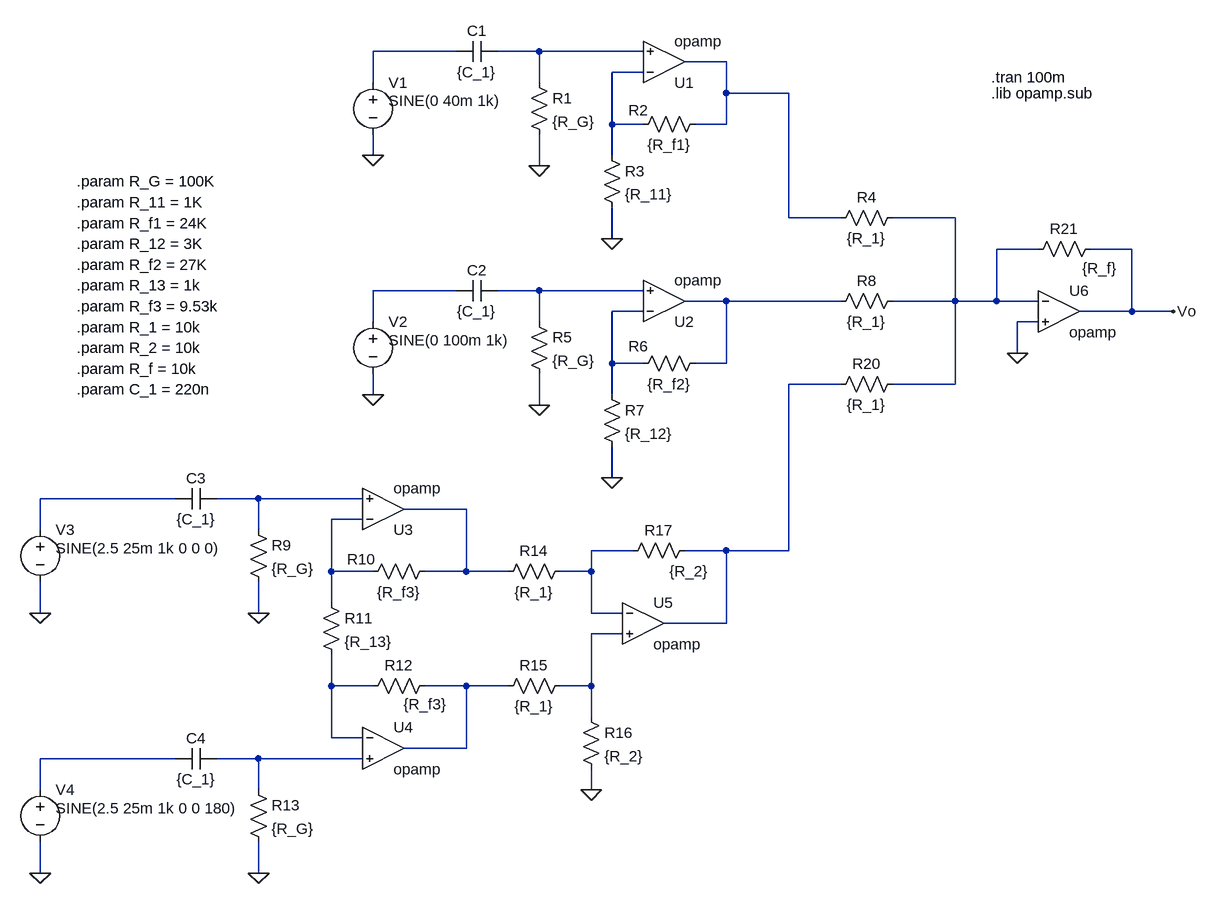
[diagram p0: schematic Mezclador_ideal.asc]
Mezclador_ideal.asc, the LTspice schematic file:
Version 4.1
SHEET 1 1080 1544
WIRE -112 96 -240 96
WIRE 16 96 -48 96
WIRE 176 96 16 96
WIRE 304 112 240 112
WIRE 176 128 128 128
WIRE -240 144 -240 96
WIRE 16 144 16 96
WIRE 304 160 304 112
WIRE 400 160 304 160
WIRE 128 208 128 128
WIRE 176 208 128 208
WIRE 304 208 304 160
WIRE 304 208 256 208
WIRE -240 256 -240 224
WIRE 128 256 128 208
WIRE 16 272 16 224
WIRE 400 352 400 160
WIRE 480 352 400 352
WIRE 656 352 560 352
WIRE 128 384 128 336
WIRE 784 400 720 400
WIRE 928 400 864 400
WIRE -112 464 -240 464
WIRE 16 464 -48 464
WIRE 176 464 16 464
WIRE 304 480 240 480
WIRE 480 480 304 480
WIRE 656 480 656 352
WIRE 656 480 560 480
WIRE 720 480 720 400
WIRE 720 480 656 480
WIRE 784 480 720 480
WIRE 176 496 128 496
WIRE 928 496 928 400
WIRE 928 496 848 496
WIRE 992 496 928 496
WIRE -240 512 -240 464
WIRE 16 512 16 464
WIRE 784 512 752 512
WIRE 752 560 752 512
WIRE 128 576 128 496
WIRE 176 576 128 576
WIRE 304 576 304 480
WIRE 304 576 256 576
WIRE 480 608 400 608
WIRE 656 608 656 480
WIRE 656 608 560 608
WIRE -240 624 -240 592
WIRE 128 624 128 576
WIRE 16 640 16 592
WIRE 128 752 128 704
WIRE -544 784 -752 784
WIRE -416 784 -480 784
WIRE -256 784 -416 784
WIRE -96 800 -192 800
WIRE -256 816 -304 816
WIRE -752 832 -752 784
WIRE -416 832 -416 784
WIRE 160 864 96 864
WIRE 304 864 240 864
WIRE 400 864 400 608
WIRE 400 864 304 864
WIRE -304 896 -304 816
WIRE -240 896 -304 896
WIRE -96 896 -96 800
WIRE -96 896 -160 896
WIRE -32 896 -96 896
WIRE 96 896 96 864
WIRE 96 896 48 896
WIRE -304 944 -304 896
WIRE -752 960 -752 912
WIRE -416 960 -416 912
WIRE 96 960 96 896
WIRE 144 960 96 960
WIRE 304 976 304 864
WIRE 304 976 208 976
WIRE 144 992 96 992
WIRE -304 1072 -304 1024
WIRE -240 1072 -304 1072
WIRE -96 1072 -160 1072
WIRE -32 1072 -96 1072
WIRE 96 1072 96 992
WIRE 96 1072 48 1072
WIRE 96 1120 96 1072
WIRE -304 1152 -304 1072
WIRE -256 1152 -304 1152
WIRE -96 1168 -96 1072
WIRE -96 1168 -192 1168
WIRE -544 1184 -752 1184
WIRE -416 1184 -480 1184
WIRE -256 1184 -416 1184
WIRE -752 1232 -752 1184
WIRE -416 1232 -416 1184
WIRE 96 1232 96 1200
WIRE -752 1360 -752 1312
WIRE -416 1360 -416 1312
FLAG 128 384 0
FLAG 128 752 0
FLAG 752 560 0
FLAG 16 272 0
FLAG 16 640 0
FLAG 992 496 Vo
FLAG -416 960 0
FLAG -416 1360 0
FLAG 96 1232 0
FLAG -752 960 0
FLAG -752 1360 0
FLAG -240 624 0
FLAG -240 256 0
SYMBOL res 272 192 R90
WINDOW 0 10 103 VBottom 2
WINDOW 3 32 56 VTop 2
SYMATTR InstName R2
SYMATTR Value {R_f1}
SYMBOL res 112 240 R0
SYMATTR InstName R3
SYMATTR Value {R_11}
SYMBOL res 272 560 R90
WINDOW 0 5 103 VBottom 2
WINDOW 3 32 56 VTop 2
SYMATTR InstName R6
SYMATTR Value {R_f2}
SYMBOL res 112 608 R0
SYMATTR InstName R7
SYMATTR Value {R_12}
SYMBOL res 576 464 R90
WINDOW 0 0 56 VBottom 2
WINDOW 3 32 56 VTop 2
SYMATTR InstName R8
SYMATTR Value {R_1}
SYMBOL res 576 336 R90
WINDOW 0 0 56 VBottom 2
WINDOW 3 32 56 VTop 2
SYMATTR InstName R4
SYMATTR Value {R_1}
SYMBOL res 576 592 R90
WINDOW 0 0 56 VBottom 2
WINDOW 3 32 56 VTop 2
SYMATTR InstName R20
SYMATTR Value {R_1}
SYMBOL res 880 384 R90
WINDOW 0 0 56 VBottom 2
WINDOW 3 30 1 VTop 2
SYMATTR InstName R21
SYMATTR Value {R_f}
SYMBOL cap -48 80 R90
WINDOW 0 0 32 VBottom 2
WINDOW 3 32 32 VTop 2
SYMATTR InstName C1
SYMATTR Value {C_1}
SYMBOL res 0 128 R0
SYMATTR InstName R1
SYMATTR Value {R_G}
SYMBOL cap -48 448 R90
WINDOW 0 0 32 VBottom 2
WINDOW 3 32 32 VTop 2
SYMATTR InstName C2
SYMATTR Value {C_1}
SYMBOL res 0 496 R0
SYMATTR InstName R5
SYMATTR Value {R_G}
SYMBOL cap -480 768 R90
WINDOW 0 0 32 VBottom 2
WINDOW 3 32 32 VTop 2
SYMATTR InstName C3
SYMATTR Value {C_1}
SYMBOL res -432 816 R0
SYMATTR InstName R9
SYMATTR Value {R_G}
SYMBOL cap -480 1168 R90
WINDOW 0 0 32 VBottom 2
WINDOW 3 32 32 VTop 2
SYMATTR InstName C4
SYMATTR Value {C_1}
SYMBOL res -432 1216 R0
SYMATTR InstName R13
SYMATTR Value {R_G}
SYMBOL res -144 880 R90
WINDOW 0 13 114 VBottom 2
WINDOW 3 32 56 VTop 2
SYMATTR InstName R10
SYMATTR Value {R_f3}
SYMBOL res -256 1088 R270
WINDOW 0 32 56 VTop 2
WINDOW 3 3 97 VBottom 2
SYMATTR InstName R12
SYMATTR Value {R_f3}
SYMBOL res -320 928 R0
SYMATTR InstName R11
SYMATTR Value {R_13}
SYMBOL res 64 1056 R90
WINDOW 0 0 56 VBottom 2
WINDOW 3 32 56 VTop 2
SYMATTR InstName R15
SYMATTR Value {R_1}
SYMBOL res 64 880 R90
WINDOW 0 0 56 VBottom 2
WINDOW 3 32 56 VTop 2
SYMATTR InstName R14
SYMATTR Value {R_1}
SYMBOL res 80 1104 R0
SYMATTR InstName R16
SYMATTR Value {R_2}
SYMBOL res 256 848 R90
WINDOW 0 0 56 VBottom 2
WINDOW 3 32 9 VTop 2
SYMATTR InstName R17
SYMATTR Value {R_2}
SYMBOL voltage -240 128 R0
WINDOW 123 24 124 Left 2
WINDOW 39 0 0 Left 0
WINDOW 3 24 44 Left 2
SYMATTR Value SINE(0 40m 1k)
SYMATTR InstName V1
SYMBOL voltage -240 496 R0
WINDOW 123 24 124 Left 2
WINDOW 39 0 0 Left 0
WINDOW 3 24 44 Left 2
SYMATTR Value SINE(0 100m 1k)
SYMATTR InstName V2
SYMBOL voltage -752 816 R0
WINDOW 123 24 124 Left 2
WINDOW 39 0 0 Left 0
WINDOW 3 24 44 Left 2
SYMATTR Value SINE(2.5 25m 1k 0 0 0)
SYMATTR InstName V3
SYMBOL voltage -752 1216 R0
WINDOW 123 24 124 Left 2
WINDOW 39 0 0 Left 0
WINDOW 3 24 44 Left 2
SYMATTR Value SINE(2.5 25m 1k 0 0 180)
SYMATTR InstName V4
SYMBOL OpAmps\\opamp 208 176 M180
SYMATTR InstName U1
SYMBOL OpAmps\\opamp 208 544 M180
SYMATTR InstName U2
SYMBOL OpAmps\\opamp -224 864 M180
SYMATTR InstName U3
SYMBOL OpAmps\\opamp -224 1104 R0
SYMATTR InstName U4
SYMBOL OpAmps\\opamp 176 912 R0
SYMATTR InstName U5
SYMBOL OpAmps\\opamp 816 432 R0
SYMATTR InstName U6
TEXT -696 328 Left 2 !.param R_11 = 1K
TEXT -696 360 Left 2 !.param R_f1 = 24K
TEXT -696 392 Left 2 !.param R_12 = 3K
TEXT -696 424 Left 2 !.param R_f2 = 27K
TEXT -696 296 Left 2 !.param R_G = 100K
TEXT -696 520 Left 2 !.param R_1 = 10k
TEXT -696 552 Left 2 !.param R_2 = 10k
TEXT -696 616 Left 2 !.param C_1 = 220n
TEXT -696 488 Left 2 !.param R_f3 = 9.53k
TEXT -696 456 Left 2 !.param R_13 = 1k
TEXT -696 584 Left 2 !.param R_f = 10k
TEXT 712 136 Left 2 !.tran 100m
TEXT 712 160 Left 2 !.lib opamp.sub

The netlist it stands for:
* Mezclador_ideal.asc
R2 N003 N004 {R_f1}
R3 N004 0 {R_11}
R6 N008 N009 {R_f2}
R7 N009 0 {R_12}
R8 N005 N008 {R_1}
R4 N005 N003 {R_1}
R20 N005 N010 {R_1}
R21 Vo N005 {R_f}
C1 N002 N001 {C_1}
R1 N002 0 {R_G}
C2 N007 N006 {C_1}
R5 N007 0 {R_G}
C3 N012 N011 {C_1}
R9 N012 0 {R_G}
C4 N020 N019 {C_1}
R13 N020 0 {R_G}
R10 N013 N014 {R_f3}
R12 N017 N018 {R_f3}
R11 N014 N017 {R_13}
R15 N016 N018 {R_1}
R14 N015 N013 {R_1}
R16 N016 0 {R_2}
R17 N010 N015 {R_2}
V1 N001 0 SINE(0 40m 1k)
V2 N006 0 SINE(0 100m 1k)
V3 N011 0 SINE(2.5 25m 1k 0 0 0)
V4 N019 0 SINE(2.5 25m 1k 0 0 180)
X§U1 N004 N002 N003 opamp Aol=100K GBW=10Meg  ; pins invin noninvin out
X§U2 N009 N007 N008 opamp Aol=100K GBW=10Meg  ; pins invin noninvin out
X§U3 N014 N012 N013 opamp Aol=100K GBW=10Meg  ; pins invin noninvin out
X§U4 N017 N020 N018 opamp Aol=100K GBW=10Meg  ; pins invin noninvin out
X§U5 N015 N016 N010 opamp Aol=100K GBW=10Meg  ; pins invin noninvin out
X§U6 N005 0 Vo opamp Aol=100K GBW=10Meg  ; pins invin noninvin out
.param R_11 = 1K
.param R_f1 = 24K
.param R_12 = 3K
.param R_f2 = 27K
.param R_G = 100K
.param R_1 = 10k
.param R_2 = 10k
.param C_1 = 220n
.param R_f3 = 9.53k
.param R_13 = 1k
.param R_f = 10k
.tran 100m
.lib opamp.sub
.backanno
.end